# Altium schematic sheet Sheet1.SchDoc
size A3
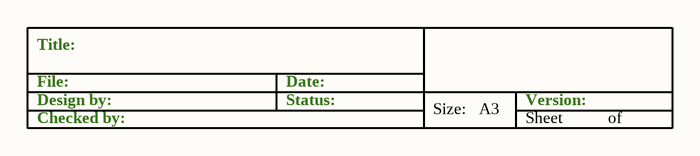
[diagram p0: Sheet1.SchDoc]

## Notes on the sheet
- Title:
- File:
- Design by:
- Date:
- Status:
- Version:
- Checked by:
- Size:
- A3
- Sheet
- of